# EAGLE design tinyJTAG-v10 (EAGLE 6.1)
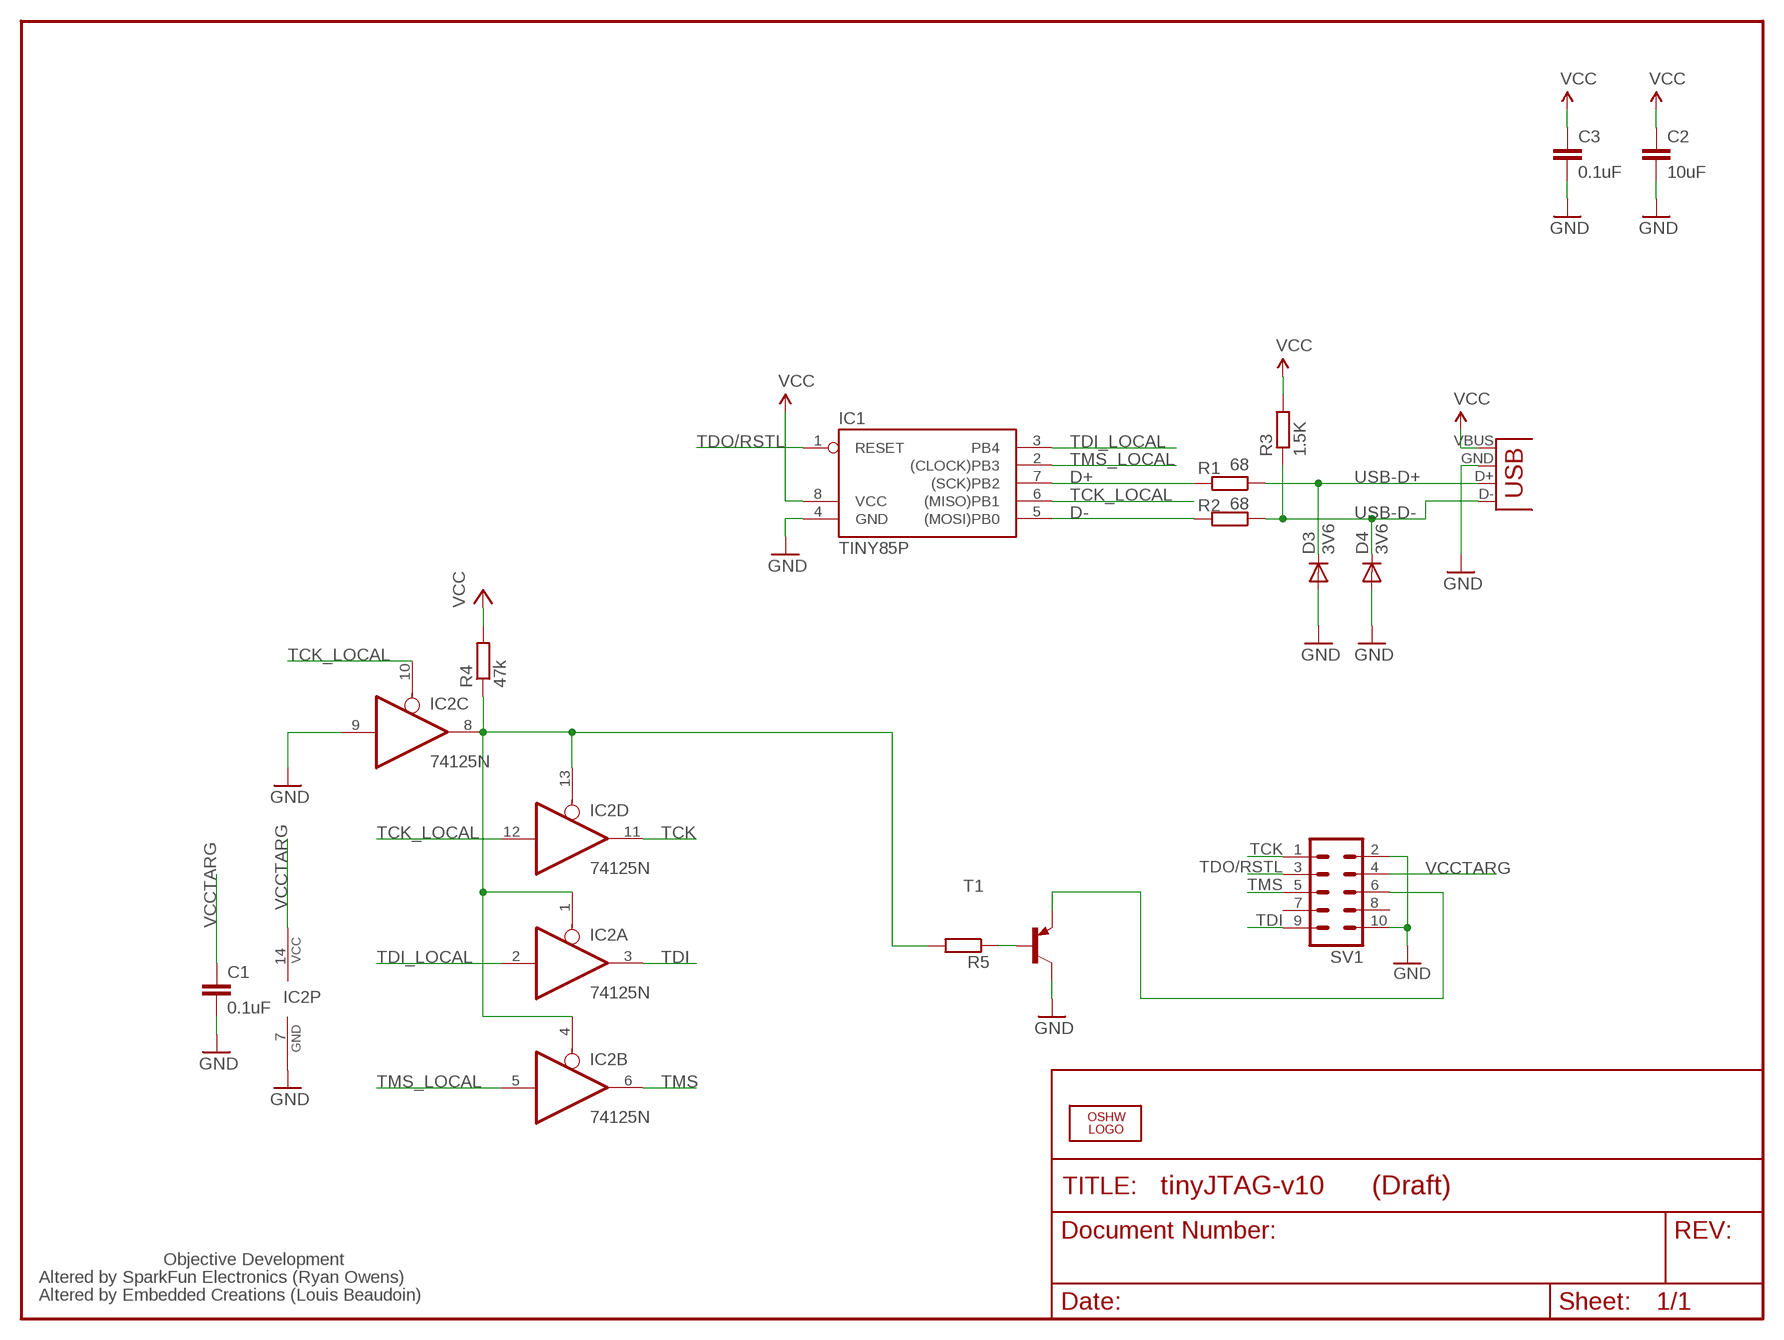
[diagram p0: schematic, sheet 1]

## Parts
C1  0.1uF  CAPPTH2  [CAP-PTH-SMALL2]
C2  10uF  C-EU025-025X050  [C025-025X050]
C3  0.1uF  CAPPTH  [CAP-PTH-SMALL]
D3  3V6  DIODE-D-2.5  [D-2.5]
D4  3V6  DIODE-D-5  [D-5]
IC1  TINY85P  [DIL08]
IC2  74125N  [DIL14]
LOGO1  OSHW_LOGO_FILLX0150-NT  [OSHW_FILLX150_NOTEXT]
R1  68  R-EU_0207/2V  [0207/2V]
R2  68  R-EU_0207/2V  [0207/2V]
R3  1.5K  R-EU_0207/2V  [0207/2V]
R4  47k  R-EU_0207/7  [0207/7]
R5  R-EU_0207/7  [0207/7]
SV1  ML10  [ML10]
T1  BC327-16-PNP-TO92-EBC  [TO92-EBC]
X1  USB-A-H  [USB-A-H]

## Nets
D+: IC1.7((SCK)PB2) R1.2
D-: IC1.5((MOSI)PB0) R2.2
GND: C1.2 C2.2 C3.2 D3.A D4.A IC1.4(GND) IC2.7(P:GND) IC2.9(C:I) SV1.2 SV1.10 T1.C X1.GND(VBUS)
N$1: IC2.1(A:OE) IC2.4(B:OE) IC2.8(C:O) IC2.13(D:OE) R4.1 R5.2
N$3: SV1.6 T1.E
N$4: R5.1 T1.B
TCK: IC2.11(D:O) SV1.1
TCK_LOCAL: IC1.6((MISO)PB1) IC2.10(C:OE) IC2.12(D:I)
TDI: IC2.3(A:O) SV1.9
TDI_LOCAL: IC1.3(PB4) IC2.2(A:I)
TDO/RSTL: IC1.1(RESET) SV1.3
TMS: IC2.6(B:O) SV1.5
TMS_LOCAL: IC1.2((CLOCK)PB3) IC2.5(B:I)
USB-D+: D3.C R1.1 X1.D+(D-)
USB-D-: D4.C R2.1 R3.1 X1.D-(D+)
VCC: C2.1 C3.1 IC1.8(VCC) R3.2 R4.2 X1.VBUS(GND)
VCCTARG: C1.1 IC2.14(P:VCC) SV1.4
Unconnected: SV1.7 SV1.8

## Notes on the sheet
- (Draft)
- Objective Development
- Altered by SparkFun Electronics (Ryan Owens)
- Altered by Embedded Creations (Louis Beaudoin)

## Library data of the parts
C1 C3 = SparkFun:CAP: Capacitor Standard 0603 ceramic capacitor, and 0.1" leaded capacitor.
C2 = rcl:C-EU: CAPACITOR, European symbol
D3 D4 = diode:DIODE-: DIODE
IC1 = atmel:TINY85: MICROCONTROLLER 1K ROM 128 bytes RAM 128 bytes EEPROM
IC2 = eclibrary:74*125: Quad bus BUFFER, 3-state
LOGO1 = ohw-logo:OSHW_LOGO_FILL
R1-R5 = rcl:R-EU_: RESISTOR, European symbol
SV1 = con-harting-ml:ML10: HARTING; OC_FARNELL: unknown; OC_NEWARK: unknown
T1 = transistor:*-PNP-: PNP Transistror
X1 = SparkFun:USB: USB Connectors USB-B-PTH is fully proven SKU : PRT-00139 USB-miniB is fully proven SKU : PRT-00587 USB-A-PCB is untested. USB-A-H is throughly reviewed, but untested. Spark Fun Electronics SKU : PRT-00437 USB-B-SMT is throughly reviewed, but untested. Needs silkscreen touching up. USB-A-S has not been used/tested USB-MB-H has not been used/tested

## Net classes
1 supply: width 0.254 mm

## Board
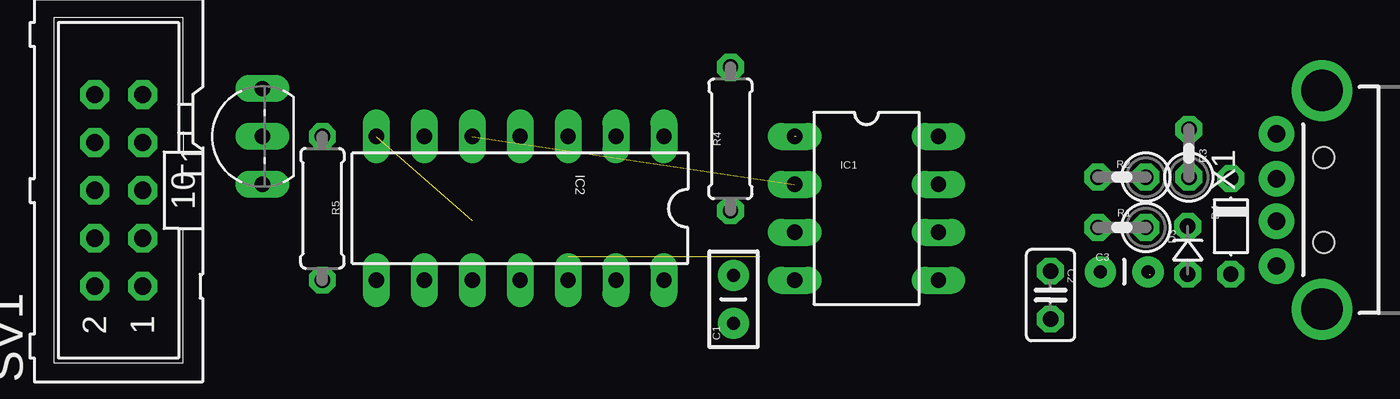
[diagram p1: board, top side]
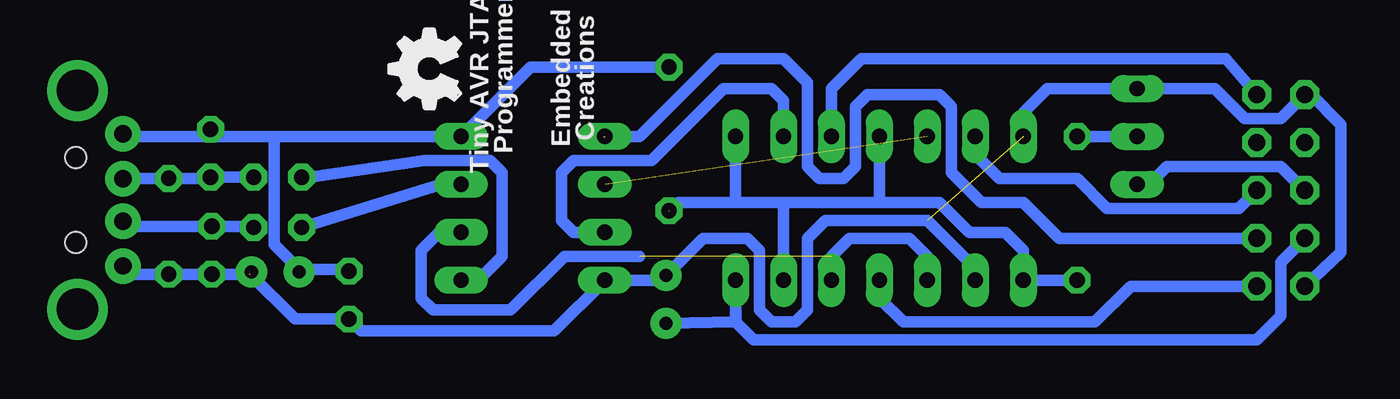
[diagram p2: board, bottom side, seen from below]

No outline drawn. Coordinates in mm, seen from the top.
Copper layers (1*16): Top 0.035mm / dielectric 1.5mm / Bottom 0.035mm
Design rules: minimum track width 6mil, minimum drill 12mil, track to track 6mil, track to pad 6mil, pad to pad 6mil, via to via 6mil, smd to smd 0mil, copper to edge 10mil, drill to drill 10mil, minimum pad ring 12mil, minimum via ring 6mil, stop-mask expansion 2mil, vias tented up to drill 100mil, thermal gap 10mil

### Footprints (pad centres in the part's own frame; a part is rotated, then mirrored left to right if it is on the bottom)
CAP-PTH-SMALL2 = drill 0.7 pad 1.651: 1 0,0; 2 2.54,0
C025-025X050 = drill 0.813 octagon: 1 -1.27,0; 2 1.27,0
CAP-PTH-SMALL = drill 0.7 pad 1.651: 1 0,0; 2 2.54,0
D-2.5 = drill 0.813 octagon: A 1.27,0; C -1.27,0
D-5 = drill 0.813 octagon: A 2.54,0; C -2.54,0
DIL08 = drill 0.813 long: 1 -3.81,-3.81; 2 -1.27,-3.81; 3 1.27,-3.81; 4 3.81,-3.81; 5 3.81,3.81; 6 1.27,3.81; 7 -1.27,3.81; 8 -3.81,3.81
DIL14 = drill 0.813 long: 1 -7.62,-3.81; 2 -5.08,-3.81; 3 -2.54,-3.81; 4 0,-3.81; 5 2.54,-3.81; 6 5.08,-3.81; 7 7.62,-3.81; 8 7.62,3.81; 9 5.08,3.81; 10 2.54,3.81; 11 0,3.81; 12 -2.54,3.81; 13 -5.08,3.81; 14 -7.62,3.81
0207/2V = drill 0.813 octagon: 1 -1.27,0; 2 1.27,0
0207/7 = drill 0.813 octagon: 1 -3.81,0; 2 3.81,0
ML10 = drill 0.914 octagon: 1 -5.08,-1.27; 2 -5.08,1.27; 3 -2.54,-1.27; 4 -2.54,1.27; 5 0,-1.27; 6 0,1.27; 7 2.54,-1.27; 8 2.54,1.27; 9 5.08,-1.27; 10 5.08,1.27
TO92-EBC = drill 0.813 long: B 0,-1.27; C 2.54,-1.27; E -2.54,-1.27
USB-A-H = drill 0.914 pad 1.88: D+ 2.4,1.127; D- 2.4,-1.127; GND 2.4,3.5; VBUS 2.4,-3.5 | drill 2.2: GND2 0,-5.8; GND3 0,5.8 | hole 1.1: -0.1,2.25; -0.1,-2.25

### Placement (x,y rotation side)
C1  16.07,-7.05 90 top
C2  32.86,-5.56 270 top
C3  35.5,-4.32 0 top
D3  40.13,-3.17 270 top
D4  42.42,-1.91 270 top
IC1  23.11,-0.95 270 top
IC2  4.76,-0.95 180 top
LOGO1  26.92,4.32 90 bottom
R1  36.64,-1.97 180 top
R2  36.64,0.7 180 top
R3  40.2,1.97 90 top
R4  15.91,2.73 90 top
R5  -5.71,-0.95 270 top
SV1  -16.51,0 90 top
T1  -10.16,2.86 90 top
X1  47.24,-0.51 180 top

### Tracks (layer width: path | path; a pad name or v marks a point on that pad's centre or on a via)
D+
  Bottom 0.61: IC1.7 28,0.32 R1.2
D-
  Bottom 0.61: R2.2 34.86,0.7 28.89,1.59 25.4,1.59 24.77,0.95 24.77,-3.49 26.04,-4.76 IC1.5
GND  (2 unrouted)
  Bottom 0.61: SV1.10 -17.84,5.14 | SV1.10 -16.51,3.81 -14.61,3.81 -13.02,5.4 T1.C -4.13,5.4 -2.86,4.13 IC2.7 | SV1.10 -18.03,5.14 -19.68,3.49 -19.68,-3.3 SV1.2 | X1.GND 44.84,-4.05 44.45,-4.45 D4.A D3.A 38.16,-4.45 C3.2 38.04,-4.51 | IC2.9 -0.32,-4.13 2.22,-1.59 7.62,-1.59 8.57,-2.54 8.57,-6.35 9.21,-6.99 10.48,-6.99 11.11,-6.35 11.11,-3.17 11.75,-2.54 14.1,-2.54 C1.2 16.32,-4.76 IC1.4 22,-7.46 32.23,-7.46 C2.2 35.72,-6.83 38.1,-4.45
N$1  (1 unrouted)
  Bottom 0.61: R5.2 IC2.8 -2.86,-3.17 -1.91,-2.22 0,-2.22 1.59,-0.64 4.76,-0.64 | 4.76,-0.64 9.84,-0.64 | 12.38,-0.64 IC2.1 | IC2.4 4.76,-0.64 | IC2.13 9.84,-0.64 | 9.84,-0.64 12.38,-0.64 | 12.38,-0.64 15.4,-0.64 15.88,-1.11
N$3
  Bottom 0.61: SV1.6 -16.51,1.27 -10.48,1.27 -9.53,0.32 T1.E
N$4
  Bottom 0.61: T1.B R5.1
TCK
  Bottom 0.61: SV1.1 -8.57,-5.08 -6.67,-6.99 3.49,-6.99 4.76,-5.71 IC2.11
TCK_LOCAL  (1 unrouted)
  Bottom 0.61: IC2.10 2.22,-3.49 3.17,-2.54 6.35,-2.54 7.3,-3.49 IC2.12 | IC1.6 28.1,-2.22 29.05,-3.17 29.05,-5.71 28.42,-6.35 24.29,-6.35 21.43,-3.49 17.46,-3.49
TDI
  Bottom 0.61: SV1.9 -13.59,6.99 5.71,6.99 7.3,5.4 IC2.3
TDI_LOCAL
  Bottom 0.61: IC2.2 9.84,4.76 10.48,5.4 13.02,5.4 16.83,1.59 20.95,1.59 21.59,0.95 21.59,-1.59 20.95,-2.22 IC1.3
TDO/RSTL  (1 unrouted)
  Bottom 0.61: SV1.3 -4.76,-2.54 -2.86,-0.64 -0.64,-0.64 0.95,0.95 0.95,4.45 1.59,5.08 5.4,5.08 6.03,4.45 6.03,1.27 6.67,0.64 7.94,0.64 8.57,1.27 8.57,5.71 9.84,6.99 13.34,6.99 17.46,2.86 19.37,2.86
TMS
  Bottom 0.61: SV1.5 -14.29,-0.95 -7.3,-0.95 -5.71,0.64 -1.59,0.64 -0.32,1.91 IC2.6
TMS_LOCAL  (1 unrouted)
USB-D+
  Bottom 0.61: X1.D+ 44.72,-1.64 44.45,-1.91 D3.C 37.97,-1.91 R1.1
USB-D-
  Bottom 0.61: X1.D- 42.43,0.62 D4.C 40.26,0.64 R3.1 R2.1
VCC
  Bottom 0.61: C3.1 35.5,-4.19 | 35.5,-4.19 36.83,-2.86 36.83,2.86 | 36.83,2.86 IC1.8 23.24,6.54 R4.2 | 36.83,2.86 40.32,2.86 | 40.32,2.86 44.71,2.86 X1.VBUS | R3.2 40.2,2.98 40.32,2.86 | 35.5,-4.19 32.96,-4.19 C2.1
VCCTARG
  Bottom 0.61: SV1.4 -16.51,-3.81 -16.51,-6.67 -15.24,-7.94 11.43,-7.94 12.38,-6.99 12.38,-5.4 | 12.38,-5.4 12.35,-6.99 C1.1 | 12.38,-5.4 IC2.14

### Text on the board
bPlace: Creations | Embedded | Programmer | Tiny AVR JTAG